# EasyEDA Pro project SPX3819M5-L-3-3.eprj

# Schematic LDO
Create Date: 2023-11-23; Page Name: P1; Project Name: LDO; Schematic Name: LDO; Update Date: 2023-11-23; Company: EasyEDA.com; Drawed: EasyEDA Pro; Page Size: A4; Part Number: JLCPCB-002; Reviewed: EasyEDA Pro; Version: V0.1
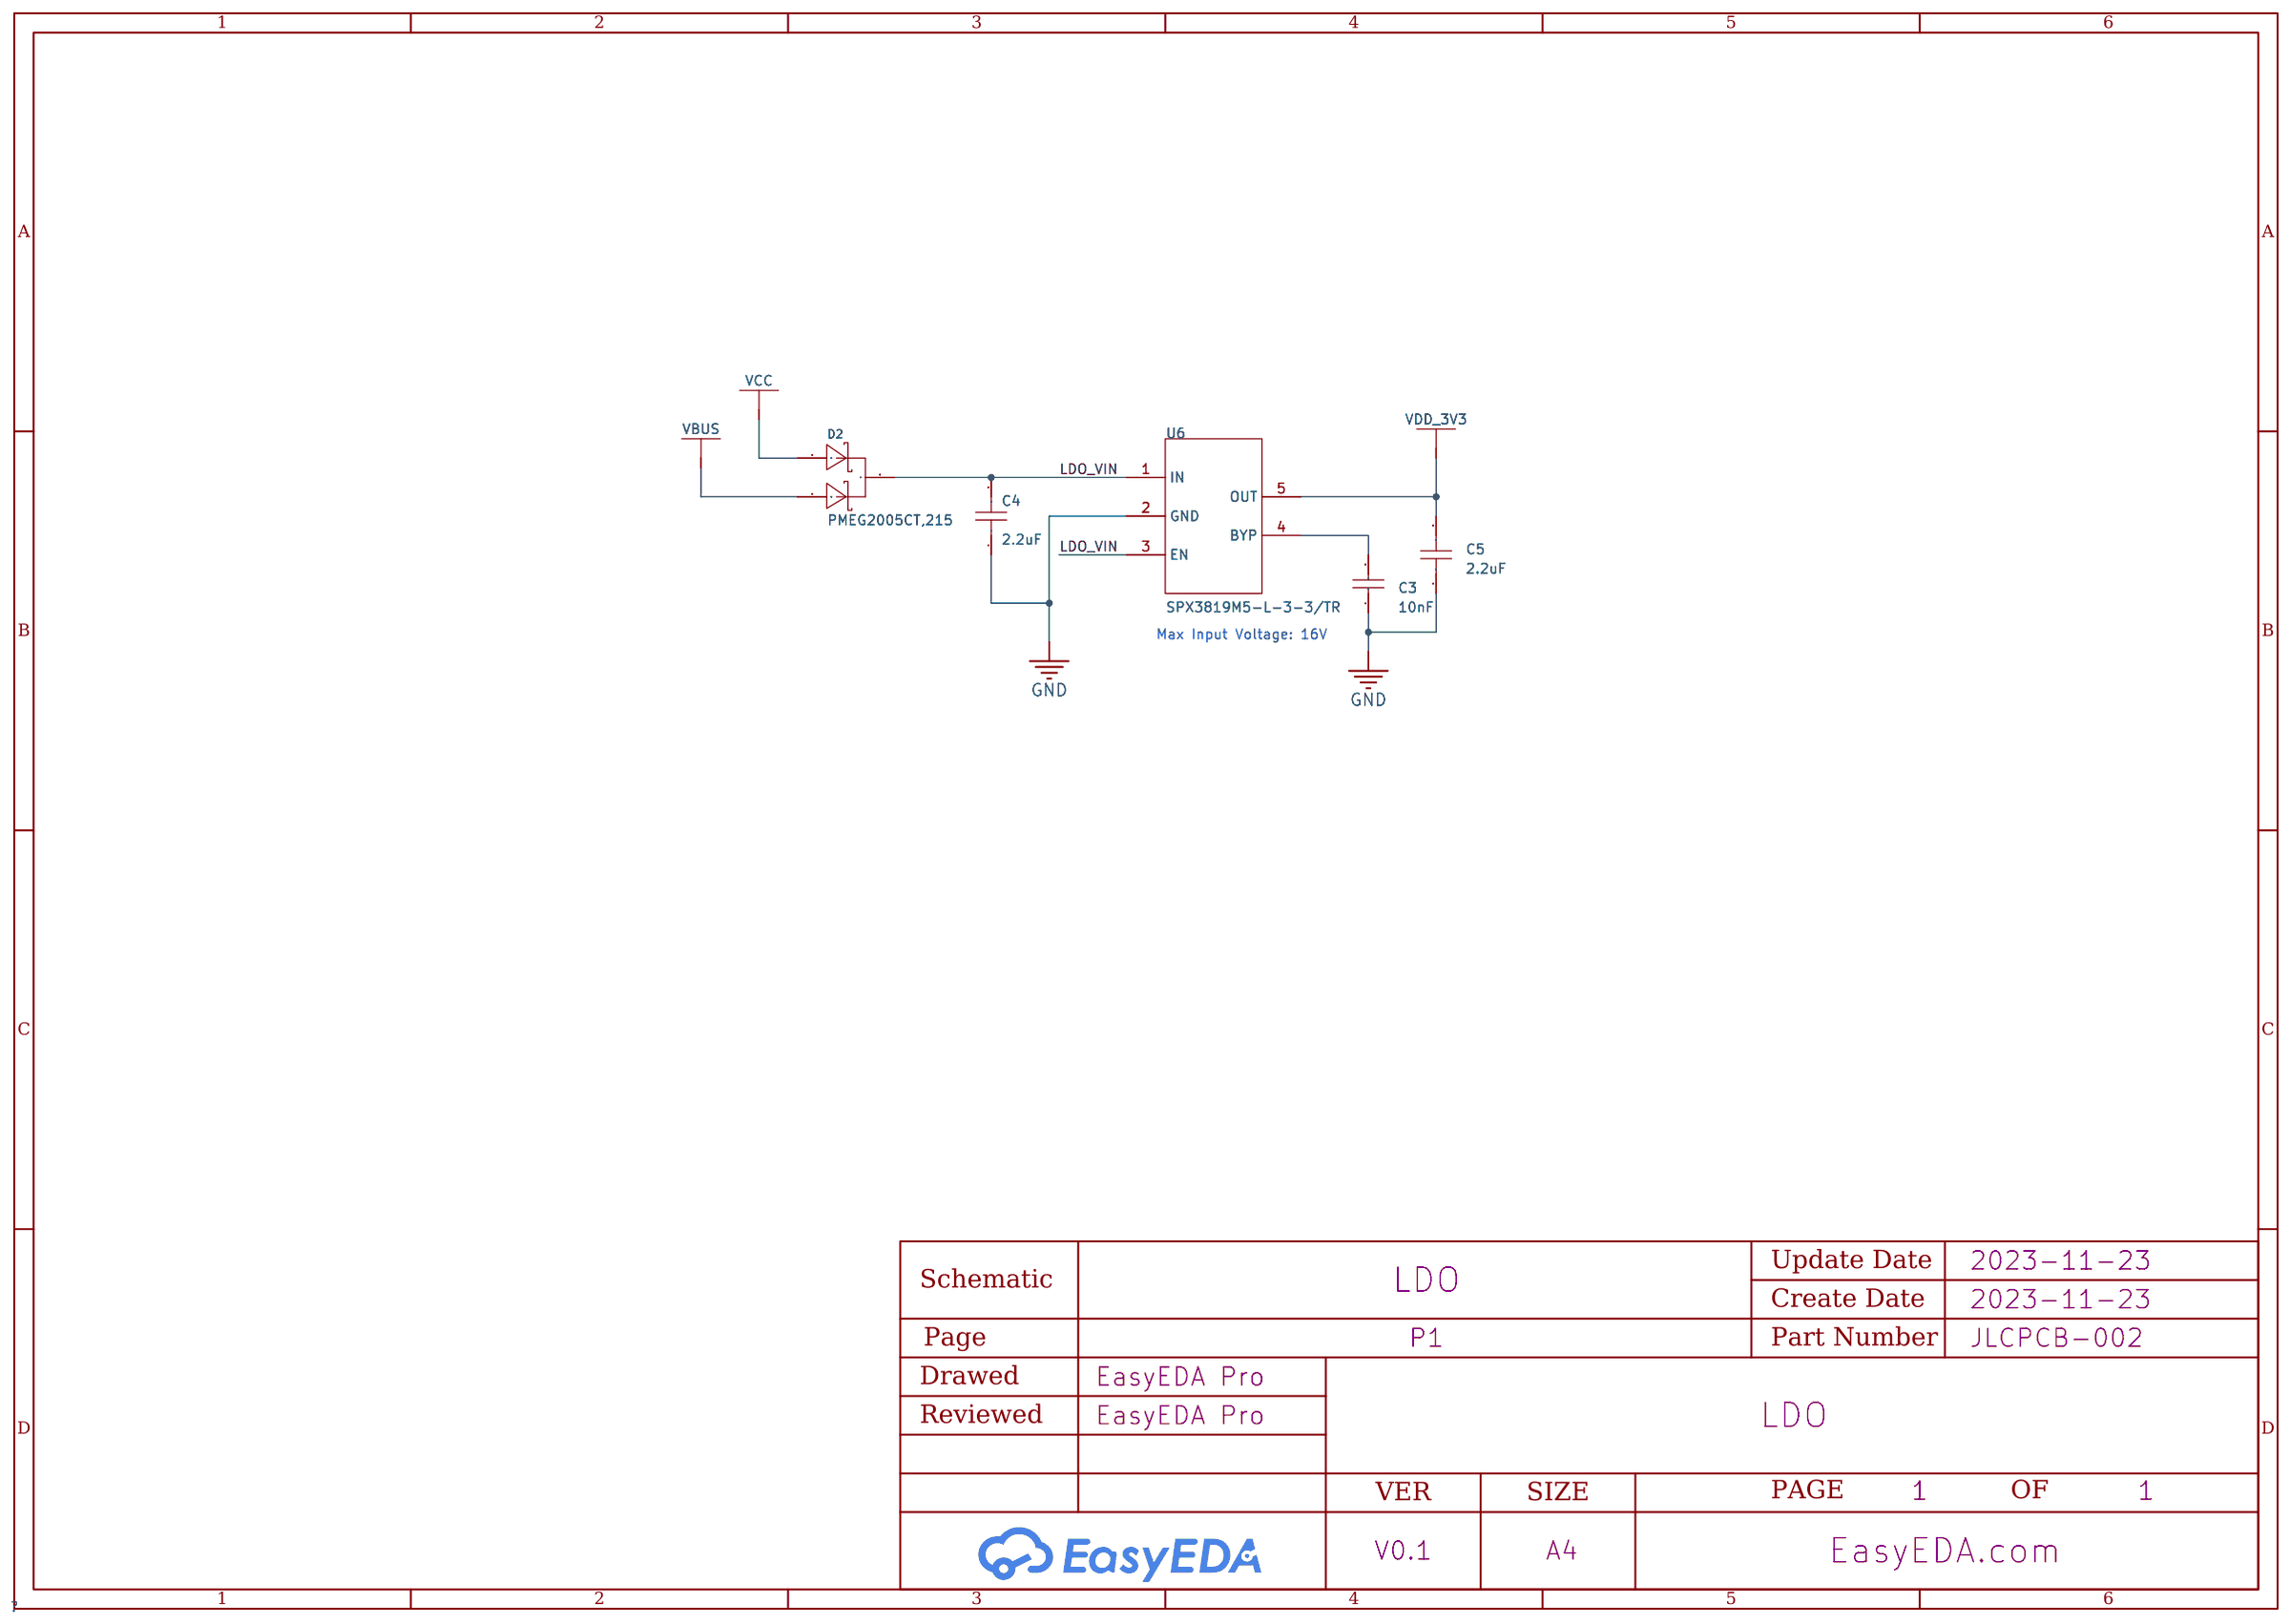
[diagram p0: schematic sheet]

## Parts
C3  10nF  [C0402]
C4  2.2uF  [C0603]
C5  2.2uF  [C0603]
D2  PMEG2005CT,215  [TO-236AB_L2.9-W1.3-P0.95-LS2.3-BR]
U6  SPX3819M5-L-3-3/TR  [SOT-23-5_L3.0-W1.7-P0.95-LS2.8-BL]

## Library data of the parts
C3 = CL05B103KB5NNNC: Capacitance: Tolerance:±10% Tolerance:±10% Voltage Rated: Temperature Coefficient:; LCSC Part Name: 10nF ±10% 50V; Supplier Part: C15195; Manufacturer: SAMSUNG(三星); Supplier Footprint: 0402; JLCPCB Part Class: Basic Part; Datasheet: https://atta.szlcsc.com/upload/public/pdf/source/20160103/1457707674468.pdf; Supplier: LCSC; Tolerance: ±10%
C4 C5 = CL10A225KA8NNNC: Capacitance: Tolerance:±10% Tolerance:±10% Voltage Rated: Temperature Coefficient:; LCSC Part Name: 2.2uF ±10% 25V; Supplier Part: C57895; Manufacturer: SAMSUNG(三星); Supplier Footprint: 0603; JLCPCB Part Class: Extended Part; Datasheet: https://atta.szlcsc.com/upload/public/pdf/source/20170325/1490427872398.pdf; Supplier: LCSC; Tolerance: ±10%
D2 = PMEG2005CT,215: Diode Configuration:Dual Common Cathode Reverse Voltage (Vr):20V Average Rectified Current (Io):500mA Forward Voltage (Vf@If):390mV@500mA Reverse Leakage Current (Ir):200uA@20V; LCSC Part Name: 电压:20V 电流:500mA; Supplier Part: C282562; Manufacturer: Nexperia(安世); Supplier Footprint: TO-236AB; JLCPCB Part Class: Extended Part; Datasheet: https://atta.szlcsc.com/upload/public/pdf/source/20181030/C282562_02DA3C8EB748154791844DC4ACB1472E.pdf; Supplier: LCSC; Diode Configuration: Dual Common Cathode; Reverse Voltage (Vr): 20V; Average Rectified Current (Io): 500mA; Forward Voltage (Vf@If): 390mV@500mA; Reverse Leakage Current (Ir): 200uA@20V
U6 = SPX3819M5-L-3-3/TR: Output Type: Output Polarity:Positive Number of Outputs:1 Maximum Input Voltage:16V Output Voltage:3.3V~3.3V Output Voltage:3.3V~3.3V Dropout Voltage:700mV@(500mA) Output Current:500mA Power Supply Rejection Ratio (PSRR):70dB; Supplier Part: C9055; Manufacturer: MaxLinear; Supplier Footprint: SOT-23-5; JLCPCB Part Class: Extended Part; Datasheet: https://atta.szlcsc.com/upload/public/pdf/source/20160421/1461205045150.pdf; Supplier: LCSC; Output Polarity: Positive; Number of Outputs: 1; Maximum Input Voltage: 16V; Output Voltage: 3.3V~3.3V; Dropout Voltage: 700mV@(500mA); Output Current: 500mA; Power Supply Rejection Ratio (PSRR): 70dB

## Nets
GND: C3.1 C4.1 C5.1 U6.2(GND)
VBUS: D2.2(A2)
VCC: D2.1(A1)
VDD_3V3: C5.2 U6.5(OUT)
LDO_VIN: C4.2 D2.3(K) U6.1(IN) U6.3(EN)
Net-(C3-2): C3.2 U6.4(BYP)

## Notes on the sheet
- Max Input Voltage: 16V
